# EAGLE design Modem (EAGLE 6.5.0)
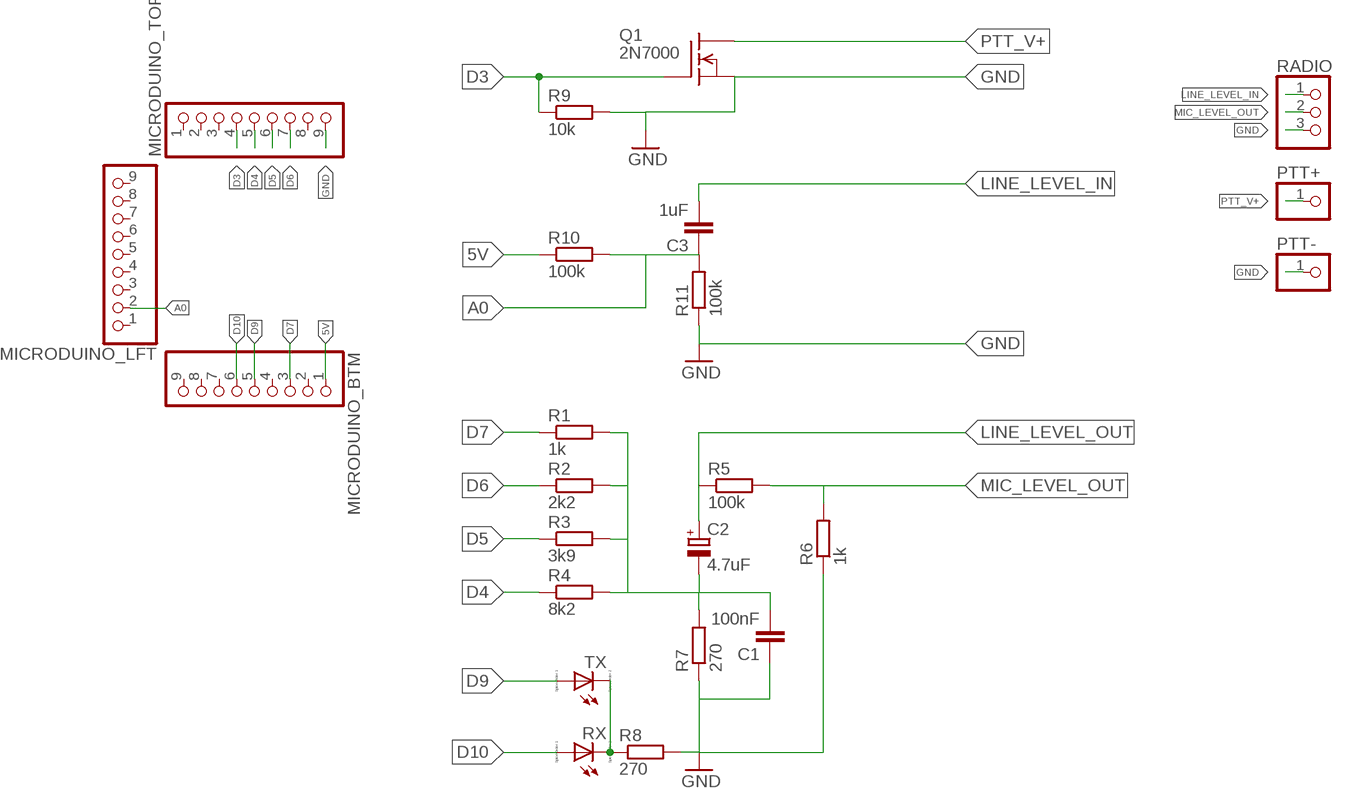
[diagram p0: schematic, sheet 1]

## Parts
C1  100nF  C2.5/2  [C2.5-2]
C2  4.7uF  CPOL-EUE2.5-5V  [E2,5-4R]
C3  1uF  C2.5/2  [C2.5-2]
MICRODUINO_BTM  PINHD-1X9  [1X09-BIG]
MICRODUINO_LFT  PINHD-1X9  [1X09-BIG]
MICRODUINO_TOP  PINHD-1X9  [1X09-BIG]
PTT+  PINHD-1X1  [1X01]
PTT-  PINHD-1X1  [1X01]
Q1  2N7000  BSS295  [TO92]
R1  1k  R-EU_0204/2V  [0204V]
R2  2k2  R-EU_0204/2V  [0204V]
R3  3k9  R-EU_0204/2V  [0204V]
R4  8k2  R-EU_0204/2V  [0204V]
R5  100k  R-EU_0204/2V  [0204V]
R6  1k  R-EU_0204/2V  [0204V]
R7  270  R-EU_0204/2V  [0204V]
R8  270  R-EU_0204/2V  [0204V]
R9  10k  R-EU_0204/2V  [0204V]
R10  100k  R-EU_0204/2V  [0204V]
R11  100k  R-EU_0204/2V  [0204V]
RADIO  PINHD-1X3  [1X03]
RX  LED_ELD260  [LED_LD260]
TX  LED_ELD260  [LED_LD260]

## Nets
5V: MICRODUINO_BTM.1 R10.1
A0: C3.1 MICRODUINO_LFT.2 R10.2 R11.2
D3: MICRODUINO_TOP.4 Q1.1(G) R9.1
D4: MICRODUINO_TOP.5 R4.1
D5: MICRODUINO_TOP.6 R3.1
D6: MICRODUINO_TOP.7 R2.1
D7: MICRODUINO_BTM.3 R1.1
D9: MICRODUINO_BTM.5 TX.A
D10: MICRODUINO_BTM.6 RX.A
GND: C1.1 MICRODUINO_TOP.9 PTT-.1 Q1.3(S) R6.1 R7.1 R8.2 R9.2 R11.1 RADIO.3
LINE_LEVEL_IN: C3.2 RADIO.1
LINE_LEVEL_OUT: C2.+ R5.1
MIC_LEVEL_OUT: R5.2 R6.2 RADIO.2
N$1: R8.1 RX.K(C) TX.K(C)
N$5: C1.2 C2.- R1.2 R2.2 R3.2 R4.2 R7.2
PTT_V+: PTT+.1 Q1.2(D)
Unconnected: MICRODUINO_BTM.2 MICRODUINO_BTM.4 MICRODUINO_BTM.7 MICRODUINO_BTM.8 MICRODUINO_BTM.9 MICRODUINO_LFT.1 MICRODUINO_LFT.3 MICRODUINO_LFT.4 MICRODUINO_LFT.5 MICRODUINO_LFT.6 MICRODUINO_LFT.7 MICRODUINO_LFT.8 MICRODUINO_LFT.9 MICRODUINO_TOP.1 MICRODUINO_TOP.2 MICRODUINO_TOP.3 MICRODUINO_TOP.8

## Library data of the parts
C1 C3 = capacitor-wima:C: CAPACITOR naming: grid - package width
C2 = resistor:CPOL-EU: POLARIZED CAPACITOR, European symbol
MICRODUINO_BTM MICRODUINO_LFT MICRODUINO_TOP = adafruit:PINHD-1X9: Pin header 1x10 0.1" spacing With round pins
PTT+ PTT- = adafruit:PINHD-1X1: Pin header 1x1 for 0.1" spacing With round pins
Q1 = transistor-fet:BSS295: N-Channel Enhancement MOSFET not checked
R1-R8 = resistor:R-EU_: RESISTOR, European symbol
R9-R11 = rcl:R-EU_: RESISTOR, European symbol
RADIO = adafruit:PINHD-1X3: PIN HEADER
RX TX = eagle-ltspice:LED_E: LED Source: http://www.osram.convergy.de Source: www.luxeon.com Source: www.kingbright.com; SPICEMODEL: NONE; SPICEPREFIX: D; SPICETYPE: diode

## Board
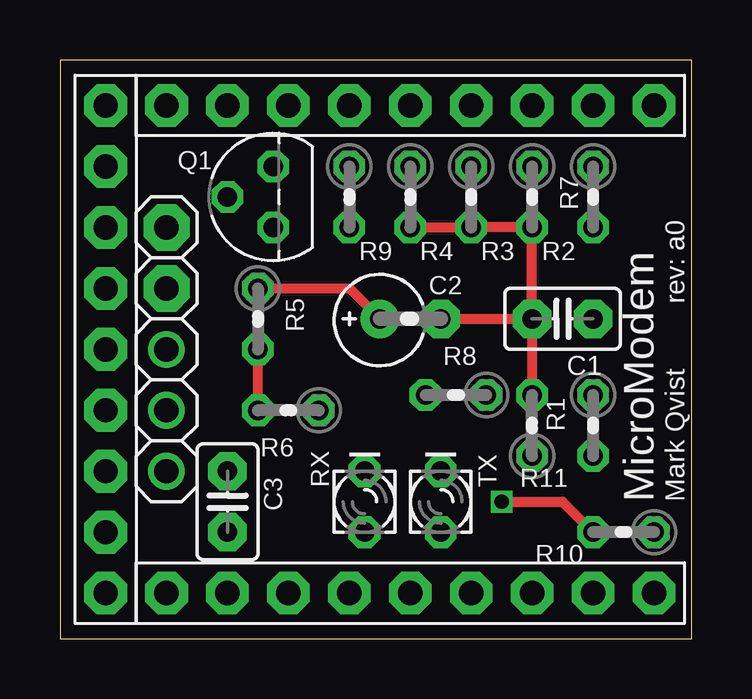
[diagram p1: board, top side]
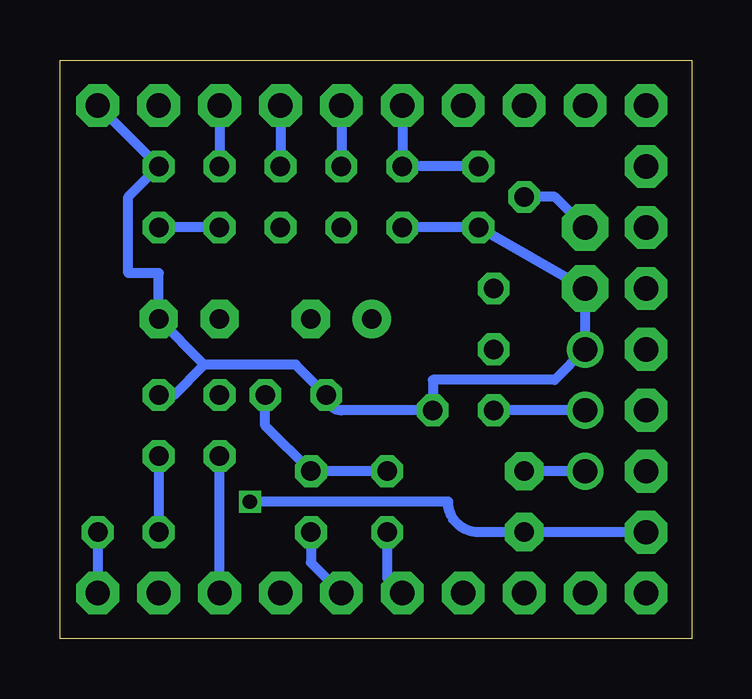
[diagram p2: board, bottom side, seen from below]

Size 26.34 x 24.12 mm. Coordinates in mm from the lower left corner, seen from the top.
Outline: 0,0 26.34,0 26.34,24.12 0,24.12 0,0
Copper layers (1*16): Top 0.035mm / dielectric 1.5mm / Bottom 0.035mm
Design rules "SeeedStudio_2layer_DRU_no_angle_20140221": minimum track width 6mil, minimum drill 12mil, track to track 6mil, track to pad 6mil, pad to pad 6mil, via to via 6mil, smd to smd 0mil, copper to edge 10mil, drill to drill 10mil, minimum pad ring 10mil, minimum via ring 6mil, stop-mask expansion 2mil, vias tented up to drill 100mil, thermal gap 10mil

### Footprints (pad centres in the part's own frame; a part is rotated, then mirrored left to right if it is on the bottom)
C2.5-2 = drill 0.813 pad 1.6 octagon: 1 -1.27,0; 2 1.27,0
E2,5-4R = drill 0.813 pad 1.6: + -1.27,0 | drill 0.813 pad 1.6 octagon: - 1.27,0
1X09-BIG = drill 1.016 pad 1.778 octagon: 1 -10.16,0; 2 -7.62,0; 3 -5.08,0; 4 -2.54,0; 5 0,0; 6 2.54,0; 7 5.08,0; 8 7.62,0; 9 10.16,0
1X01 = drill 1.016 pad 1.93 octagon: 1 0,0
TO92 = drill 0.813 octagon: 1 1.27,0; 2 0,1.905; 3 -1.27,0
0204V = drill 0.813 octagon: 1 -1.27,0; 2 1.27,0
1X03 = drill 1.016: 1 -2.54,0; 2 0,0; 3 2.54,0
LED_LD260 = drill 0.813 octagon: A -1.27,0; K 1.27,0

### Placement (x,y rotation side)
C1  20.96,13.33 180 top
C2  14.61,13.33 0 top
C3  6.98,5.71 90 top
MICRODUINO_BTM  14.61,1.9 180 top
MICRODUINO_LFT  1.91,12.06 90 top
MICRODUINO_TOP  14.61,22.23 0 top
PTT+  4.45,17.15 90 top
PTT-  4.45,14.6 90 top
Q1  8.89,18.41 90 top
R1  19.68,8.89 90 top
R2  19.68,18.41 270 top
R3  17.14,18.41 270 top
R4  14.61,18.41 270 top
R5  8.25,13.33 270 top
R6  9.53,9.52 180 top
R7  22.22,18.41 270 top
R8  16.51,10.16 180 top
R9  12.07,18.41 270 top
R10  23.5,4.45 180 top
R11  22.22,8.89 270 top
RADIO  4.45,9.52 90 top
RX  12.7,5.71 90 top
TX  15.88,5.71 90 top

### Tracks (layer width: path | path; a pad name or v marks a point on that pad's centre or on a via)
5V
  Bottom 0.406: R10.1 MICRODUINO_BTM.1
A0  (via drill 0.6)
  Top 0.406: v18.42,5.71 20.96,5.71 R10.2
  Bottom 0.406: R11.2 R10.2 | MICRODUINO_LFT.2 C3.1 8.89,4.45 arc90 10.16,5.71 v18.42,5.71
D3
  Bottom 0.406: MICRODUINO_TOP.4 R9.1 Q1.1
D4
  Bottom 0.406: MICRODUINO_TOP.5 R4.1
D5
  Bottom 0.406: MICRODUINO_TOP.6 R3.1
D6
  Bottom 0.406: MICRODUINO_TOP.7 R2.1
D7
  Bottom 0.406: MICRODUINO_BTM.3 R1.1
D9
  Bottom 0.406: TX.A 15.88,3.17 MICRODUINO_BTM.5
D10
  Bottom 0.406: RX.A 12.7,2.54 MICRODUINO_BTM.6
GND
  Bottom 0.406: MICRODUINO_TOP.9 R7.1 23.5,18.41 23.5,15.24 22.22,15.24 C1.1 20.32,11.43 | R9.2 Q1.3 PTT-.1 RADIO.3 5.71,10.79 10.8,10.79 R6.1 14.61,9.52 arc90 R8.2 16.51,11.43 20.32,11.43 | R11.1 21.59,10.16 20.32,11.43
LINE_LEVEL_IN
  Bottom 0.406: RADIO.1 C3.2
LINE_LEVEL_OUT
  Top 0.406: R5.1 12.07,14.6 C2.+
MIC_LEVEL_OUT
  Top 0.406: R6.2 R5.2
  Bottom 0.406: RADIO.2 R6.2
N$1
  Bottom 0.406: R8.1 17.78,8.89 TX.K RX.K
N$5
  Top 0.406: C2.- C1.2 | C1.2 R1.2 | C1.2 R2.2 R3.2 R4.2
  Bottom 0.406: R2.2 R7.2
PTT_V+
  Bottom 0.406: PTT+.1 5.71,18.41 Q1.2

### Text on the board
tPlace: rev: a0 | MicroModem | Mark Qvist